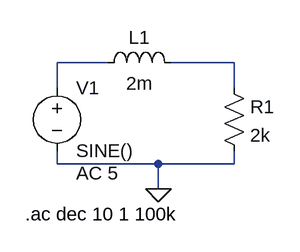
[diagram p0: schematic Low Pass RL Filter.asc]
Low Pass RL Filter.asc, the LTspice schematic file:
Version 4
SHEET 1 880 680
WIRE 192 112 128 112
WIRE 352 112 272 112
WIRE 128 144 128 112
WIRE 352 144 352 112
WIRE 128 240 128 224
WIRE 256 240 128 240
WIRE 352 240 352 224
WIRE 352 240 256 240
WIRE 256 272 256 240
FLAG 256 272 0
SYMBOL voltage 128 128 R0
WINDOW 123 24 124 Left 2
WINDOW 39 0 0 Left 0
SYMATTR Value2 AC 5
SYMATTR InstName V1
SYMATTR Value SINE()
SYMBOL res 336 128 R0
SYMATTR InstName R1
SYMATTR Value 2k
SYMBOL ind 176 128 R270
WINDOW 0 32 56 VTop 2
WINDOW 3 5 56 VBottom 2
SYMATTR InstName L1
SYMATTR Value 2m
TEXT 88 304 Left 2 !.ac dec 10 1 100k

The netlist it stands for:
* Low Pass RL Filter.asc
V1 N001 0 SINE() AC 5
R1 N002 0 2k
L1 N001 N002 2m
.ac dec 10 1 100k
.backanno
.end